# Altium schematic sheet 02-MCU.SchDoc
size A3
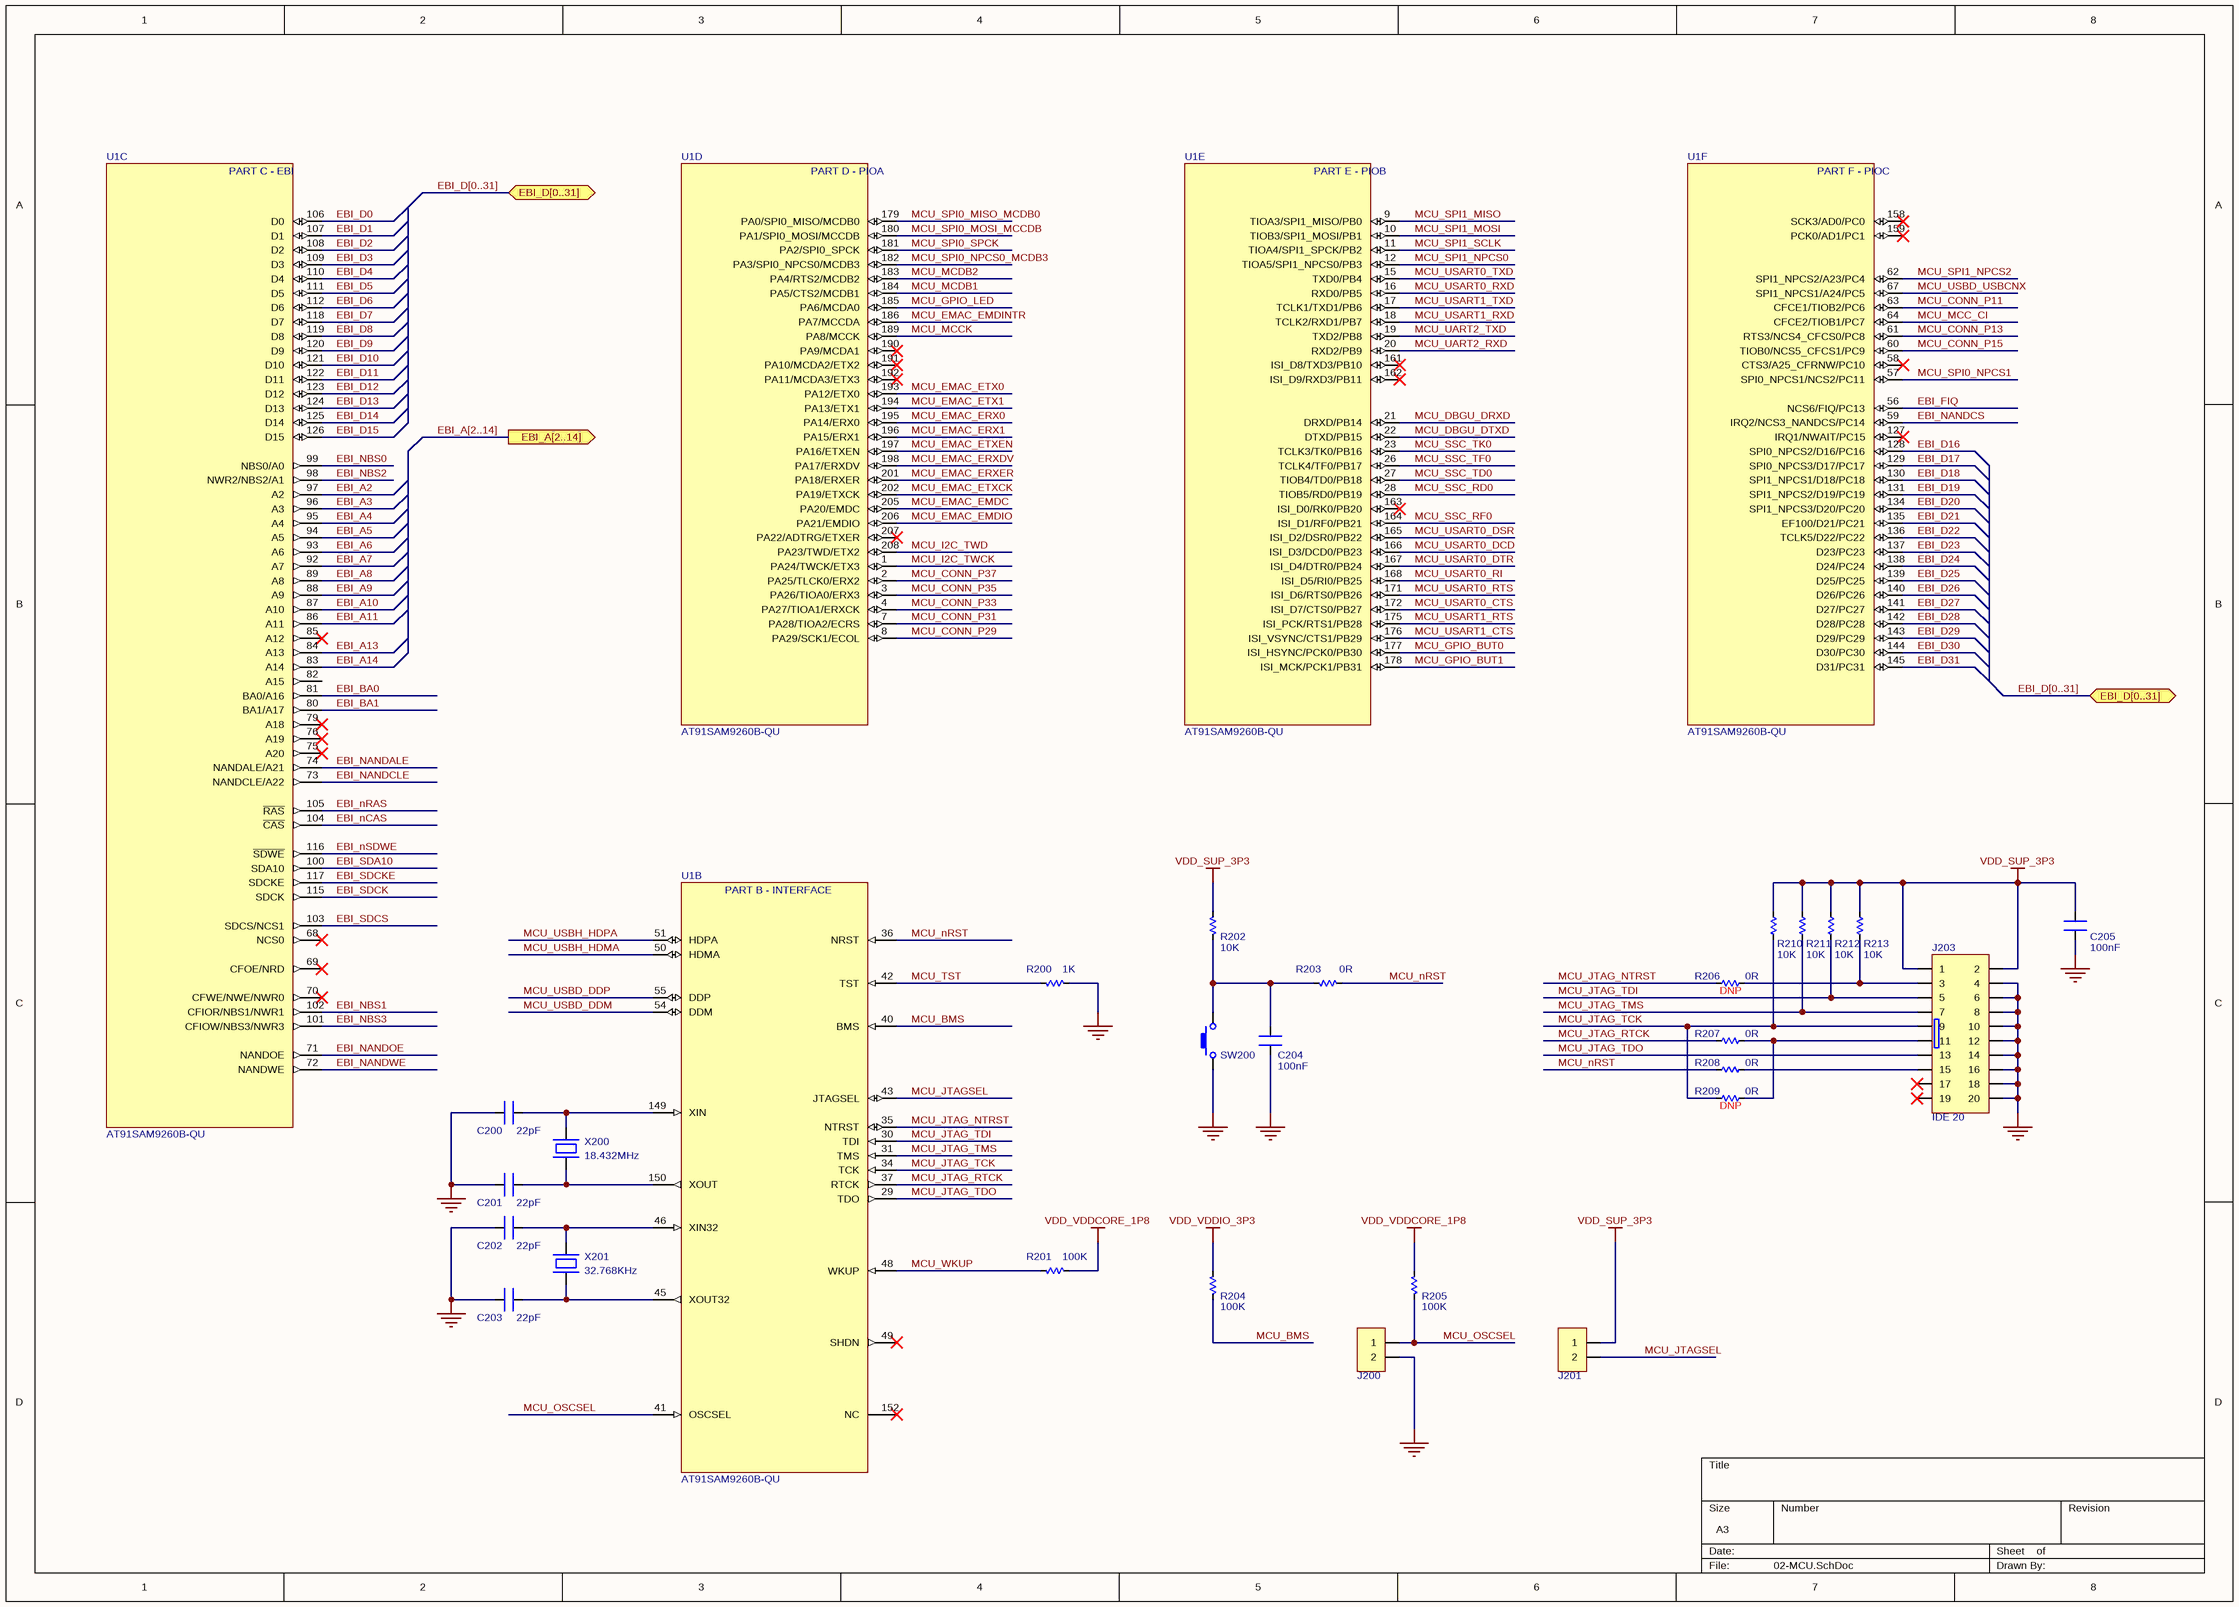
[diagram p0: 02-MCU.SchDoc]

## Parts
C200  value 22pF  [CN-SMD-0603]  (hidden comment: Capacitor)
C201  value 22pF  [CN-SMD-0603]  (hidden comment: Capacitor)
C202  value 22pF  [CN-SMD-0603]  (hidden comment: Capacitor)
C203  value 22pF  [CN-SMD-0603]  (hidden comment: Capacitor)
C204  value 100nF  [CN-SMD-0603]  (hidden comment: Capacitor)
C205  value 100nF  [CN-SMD-0603]  (hidden comment: Capacitor)
J200  JP2  [JP2-C1T]  (value not drawn)
J201  JP2  [JP2-C1T]  (value not drawn)
J203  IDE 20  [IDE-20V]
R200  value 1K  [RES-SMD-0603]  (hidden comment: Resistor)
R201  value 100K  [RES-SMD-0603]  (hidden comment: Resistor)
R202  value 10K  [RES-SMD-0603]  (hidden comment: Resistor)
R203  value 0R  [RES-SMD-0603]  (hidden comment: Resistor)
R204  value 100K  [RES-SMD-0603]  (hidden comment: Resistor)
R205  value 100K  [RES-SMD-0603]  (hidden comment: Resistor)
R206  value 0R  [RES-SMD-0603]  (hidden comment: Resistor)
R207  value 0R  [RES-SMD-0603]  (hidden comment: Resistor)
R208  value 0R  [RES-SMD-0603]  (hidden comment: Resistor)
R209  value 0R  [RES-SMD-0603]  (hidden comment: Resistor)
R210  value 10K  [RES-SMD-0603]  (hidden comment: Resistor)
R211  value 10K  [RES-SMD-0603]  (hidden comment: Resistor)
R212  value 10K  [RES-SMD-0603]  (hidden comment: Resistor)
R213  value 10K  [RES-SMD-0603]  (hidden comment: Resistor)
SW200  SW2  [SW2-SMD-3x4x2M]  (value not drawn)
U1  AT91SAM9260B-QU  [PQFP50P3060X3060X410-208N]  (parts B,C,D,E,F of 6)
X200  value 18.432MHz  [XT-SMD-5032-2P]  (hidden comment: Crystal)
X201  value 32.768KHz  [XT-SMD-FC-135]  (hidden comment: Crystal)

## Ports
EBI_A[2..14] (out), EBI_D[0..31] (bidir)

## Nets
GND: C200.2 C201.2 C202.2 C203.2 C204.1 C205.1 J200.2 J203.4 J203.6 J203.8 J203.10 J203.12 J203.14 J203.16 J203.18 J203.20 R200.1 SW200.1
VDD_SUP_3P3: C205.2 J201.1 J203.1 J203.2 R202.1 R210.1 R211.1 R212.1 R213.1
VDD_VDDCORE_1P8: R201.1 R205.1
VDD_VDDIO_3P3: R204.1
EBI_A2: U1.97(A2)
EBI_A3: U1.96(A3)
EBI_A4: U1.95(A4)
EBI_A5: U1.94(A5)
EBI_A6: U1.93(A6)
EBI_A7: U1.92(A7)
EBI_A8: U1.89(A8)
EBI_A9: U1.88(A9)
EBI_A10: U1.87(A10)
EBI_A11: U1.86(A11)
EBI_A13: U1.84(A13)
EBI_A14: U1.83(A14)
EBI_BA0: U1.81(BA0/A16)
EBI_BA1: U1.80(BA1/A17)
EBI_D0: U1.106(D0)
EBI_D1: U1.107(D1)
EBI_D2: U1.108(D2)
EBI_D3: U1.109(D3)
EBI_D4: U1.110(D4)
EBI_D5: U1.111(D5)
EBI_D6: U1.112(D6)
EBI_D7: U1.118(D7)
EBI_D8: U1.119(D8)
EBI_D9: U1.120(D9)
EBI_D10: U1.121(D10)
EBI_D11: U1.122(D11)
EBI_D12: U1.123(D12)
EBI_D13: U1.124(D13)
EBI_D14: U1.125(D14)
EBI_D15: U1.126(D15)
EBI_D16: U1.128(SPI0_NPCS2/D16/PC16)
EBI_D17: U1.129(SPI0_NPCS3/D17/PC17)
EBI_D18: U1.130(SPI1_NPCS1/D18/PC18)
EBI_D19: U1.131(SPI1_NPCS2/D19/PC19)
EBI_D20: U1.134(SPI1_NPCS3/D20/PC20)
EBI_D21: U1.135(EF100/D21/PC21)
EBI_D22: U1.136(TCLK5/D22/PC22)
EBI_D23: U1.137(D23/PC23)
EBI_D24: U1.138(D24/PC24)
EBI_D25: U1.139(D25/PC25)
EBI_D26: U1.140(D26/PC26)
EBI_D27: U1.141(D27/PC27)
EBI_D28: U1.142(D28/PC28)
EBI_D29: U1.143(D29/PC29)
EBI_D30: U1.144(D30/PC30)
EBI_D31: U1.145(D31/PC31)
EBI_FIQ: U1.56(NCS6/FIQ/PC13)
EBI_NANDALE: U1.74(NANDALE/A21)
EBI_NANDCLE: U1.73(NANDCLE/A22)
EBI_NANDCS: U1.59(IRQ2/NCS3_NANDCS/PC14)
EBI_NANDOE: U1.71(NANDOE)
EBI_NANDWE: U1.72(NANDWE)
EBI_NBS0: U1.99(NBS0/A0)
EBI_NBS1: U1.102(CFIOR/NBS1/NWR1)
EBI_NBS2: U1.98(NWR2/NBS2/A1)
EBI_NBS3: U1.101(CFIOW/NBS3/NWR3)
EBI_nCAS: U1.104(~{CAS})
EBI_nRAS: U1.105(~{RAS})
EBI_nSDWE: U1.116(~{SDWE})
EBI_SDA10: U1.100(SDA10)
EBI_SDCK: U1.115(SDCK)
EBI_SDCKE: U1.117(SDCKE)
EBI_SDCS: U1.103(SDCS/NCS1)
MCU_BMS: R204.2 U1.40(BMS)
MCU_CONN_P11: U1.63(CFCE1/TIOB2/PC6)
MCU_CONN_P13: U1.61(RTS3/NCS4_CFCS0/PC8)
MCU_CONN_P15: U1.60(TIOB0/NCS5_CFCS1/PC9)
MCU_CONN_P29: U1.8(PA29/SCK1/ECOL)
MCU_CONN_P31: U1.7(PA28/TIOA2/ECRS)
MCU_CONN_P33: U1.4(PA27/TIOA1/ERXCK)
MCU_CONN_P35: U1.3(PA26/TIOA0/ERX3)
MCU_CONN_P37: U1.2(PA25/TLCK0/ERX2)
MCU_DBGU_DRXD: U1.21(DRXD/PB14)
MCU_DBGU_DTXD: U1.22(DTXD/PB15)
MCU_EMAC_EMDC: U1.205(PA20/EMDC)
MCU_EMAC_EMDINTR: U1.186(PA7/MCCDA)
MCU_EMAC_EMDIO: U1.206(PA21/EMDIO)
MCU_EMAC_ERX0: U1.195(PA14/ERX0)
MCU_EMAC_ERX1: U1.196(PA15/ERX1)
MCU_EMAC_ERXDV: U1.198(PA17/ERXDV)
MCU_EMAC_ERXER: U1.201(PA18/ERXER)
MCU_EMAC_ETX0: U1.193(PA12/ETX0)
MCU_EMAC_ETX1: U1.194(PA13/ETX1)
MCU_EMAC_ETXCK: U1.202(PA19/ETXCK)
MCU_EMAC_ETXEN: U1.197(PA16/ETXEN)
MCU_GPIO_BUT0: U1.177(ISI_HSYNC/PCK0/PB30)
MCU_GPIO_BUT1: U1.178(ISI_MCK/PCK1/PB31)
MCU_GPIO_LED: U1.185(PA6/MCDA0)
MCU_I2C_TWCK: U1.1(PA24/TWCK/ETX3)
MCU_I2C_TWD: U1.208(PA23/TWD/ETX2)
MCU_JTAG_NTRST: R206.2 U1.35(NTRST)
MCU_JTAG_RTCK: R207.2 U1.37(RTCK)
MCU_JTAG_TCK: J203.9 R209.2 R210.2 U1.34(TCK)
MCU_JTAG_TDI: J203.5 R212.2 U1.30(TDI)
MCU_JTAG_TDO: J203.13 U1.29(TDO)
MCU_JTAG_TMS: J203.7 R211.2 U1.31(TMS)
MCU_JTAGSEL: J201.2 U1.43(JTAGSEL)
MCU_MCC_CI: U1.64(CFCE2/TIOB1/PC7)
MCU_MCCK: U1.189(PA8/MCCK)
MCU_MCDB1: U1.184(PA5/CTS2/MCDB1)
MCU_MCDB2: U1.183(PA4/RTS2/MCDB2)
MCU_nRST: R203.2 R208.2 U1.36(NRST)
MCU_OSCSEL: J200.1 R205.2 U1.41(OSCSEL)
MCU_SPI0_MISO_MCDB0: U1.179(PA0/SPI0_MISO/MCDB0)
MCU_SPI0_MOSI_MCCDB: U1.180(PA1/SPI0_MOSI/MCCDB)
MCU_SPI0_NPCS0_MCDB3: U1.182(PA3/SPI0_NPCS0/MCDB3)
MCU_SPI0_NPCS1: U1.57(SPI0_NPCS1/NCS2/PC11)
MCU_SPI0_SPCK: U1.181(PA2/SPI0_SPCK)
MCU_SPI1_MISO: U1.9(TIOA3/SPI1_MISO/PB0)
MCU_SPI1_MOSI: U1.10(TIOB3/SPI1_MOSI/PB1)
MCU_SPI1_NPCS0: U1.12(TIOA5/SPI1_NPCS0/PB3)
MCU_SPI1_NPCS2: U1.62(SPI1_NPCS2/A23/PC4)
MCU_SPI1_SCLK: U1.11(TIOA4/SPI1_SPCK/PB2)
MCU_SSC_RD0: U1.28(TIOB5/RD0/PB19)
MCU_SSC_RF0: U1.164(ISI_D1/RF0/PB21)
MCU_SSC_TD0: U1.27(TIOB4/TD0/PB18)
MCU_SSC_TF0: U1.26(TCLK4/TF0/PB17)
MCU_SSC_TK0: U1.23(TCLK3/TK0/PB16)
MCU_TST: R200.2 U1.42(TST)
MCU_UART2_RXD: U1.20(RXD2/PB9)
MCU_UART2_TXD: U1.19(TXD2/PB8)
MCU_USART0_CTS: U1.172(ISI_D7/CTS0/PB27)
MCU_USART0_DCD: U1.166(ISI_D3/DCD0/PB23)
MCU_USART0_DSR: U1.165(ISI_D2/DSR0/PB22)
MCU_USART0_DTR: U1.167(ISI_D4/DTR0/PB24)
MCU_USART0_RI: U1.168(ISI_D5/RI0/PB25)
MCU_USART0_RTS: U1.171(ISI_D6/RTS0/PB26)
MCU_USART0_RXD: U1.16(RXD0/PB5)
MCU_USART0_TXD: U1.15(TXD0/PB4)
MCU_USART1_CTS: U1.176(ISI_VSYNC/CTS1/PB29)
MCU_USART1_RTS: U1.175(ISI_PCK/RTS1/PB28)
MCU_USART1_RXD: U1.18(TCLK2/RXD1/PB7)
MCU_USART1_TXD: U1.17(TCLK1/TXD1/PB6)
MCU_USBD_DDM: U1.54(DDM)
MCU_USBD_DDP: U1.55(DDP)
MCU_USBD_USBCNX: U1.67(SPI1_NPCS1/A24/PC5)
MCU_USBH_HDMA: U1.50(HDMA)
MCU_USBH_HDPA: U1.51(HDPA)
MCU_WKUP: R201.2 U1.48(WKUP)
NetC200_1: C200.1 U1.149(XIN) X200.1
NetC201_1: C201.1 U1.150(XOUT) X200.2
NetC202_1: C202.1 U1.46(XIN32) X201.1
NetC203_1: C203.1 U1.45(XOUT32) X201.2
NetC204_2: C204.2 R202.2 R203.1 SW200.2
NetJ203_3: J203.3 R206.1 R213.2
NetJ203_11: J203.11 R207.1 R209.1
NetJ203_15: J203.15 R208.1

Not connected (* = marked no-connect by the designer): J203 17* 19*; U1 49(SHDN)* 58(CTS3/A25_CFRNW/PC10)* 68(NCS0)* 69(CFOE/NRD)* 70(CFWE/NWE/NWR0)* 75(A20)* 76(A19)* 79(A18)* 82(A15) 85(A12)* 127(IRQ1/NWAIT/PC15)* 152(NC)* 158(SCK3/AD0/PC0)* 159(PCK0/AD1/PC1)* 161(ISI_D8/TXD3/PB10)* 162(ISI_D9/RXD3/PB11)* 163(ISI_D0/RK0/PB20)* 190(PA9/MCDA1)* 191(PA10/MCDA2/ETX2)* 192(PA11/MCDA3/ETX3)* 207(PA22/ADTRG/ETXER)*

## Buses and harness runs
bus EBI_A[2..14] = port EBI_A[2..14]
bus EBI_D[0..31] = port EBI_D[0..31]

## Notes on the sheet
- (near R206) DNP
- (near R209) DNP
- (in symbol AT91SAM9260B-QU, part B) PART B - INTERFACE
- (in symbol AT91SAM9260B-QU, part C) PART C - EBI
- (in symbol AT91SAM9260B-QU, part D) PART D - PIOA
- (in symbol AT91SAM9260B-QU, part E) PART E - PIOB
- (in symbol AT91SAM9260B-QU, part F) PART F - PIOC

## Library data of the parts
C200-C203 = Cap: Ceramic Capacitor SMD 0603 22pF ±20% 10V
C204 C205 = Cap: Ceramic Capacitor SMD 0603 100nF ±20% 10V
J200 J201 = JP2: Single 2-pin jumper
J203 = IDE 20: IDE-20 male 2.54mm right-angle header; Value: Header 5x2
R200 = Res: Resistor SMD 0603 1K 1% 0.1W
R201 R204 R205 = Res: Resistor SMD 0603 100K 1% 0.1W
R202 R210-R213 = Res: Resistor SMD 0603 10K 1% 0.1W
R203 R206-R209 = Res: Resistor SMD 0603 0R 1% 0.1W
SW200 = SW2: Switch 2-pin SMD 3x4x2mm
U1 = AT91SAM9260B-QU: AT91 Series 180 MHz 32 kB Flash 8 kB SRAM 32-Bit Microcontroller - PQFP-208; MF: Microchip; MP: AT91SAM9260B-QU; Package: PQFP-208 Microchip; Price: None; SnapEDA_Link: https://www.snapeda.com/parts/AT91SAM9260B-QU/Microchip/view-part/?ref=snap; Availability: Unavailable; Value: *
X200 = XT2: Crystal Oscillator 18.432MHz SMD-5032 2-pin
X201 = XT2: Crystal Oscillator 32.768KHz FC-135 2-pin